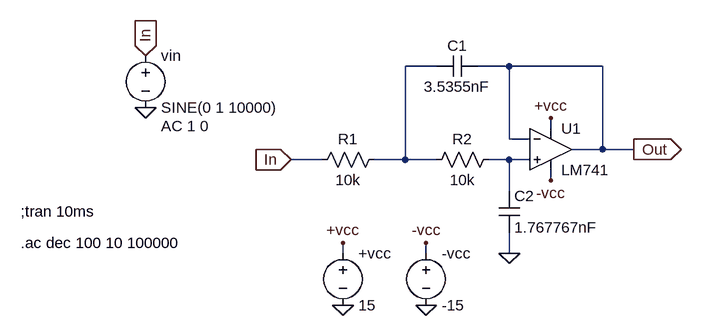
[diagram p0: schematic Butterworth.asc]
Butterworth.asc, the LTspice schematic file:
Version 4
SHEET 1 880 680
WIRE -16 16 -64 16
WIRE 96 16 48 16
WIRE 240 16 96 16
WIRE 160 112 160 96
WIRE 96 128 96 16
WIRE 128 128 96 128
WIRE 240 144 240 16
WIRE 240 144 192 144
WIRE 288 144 240 144
WIRE -192 160 -240 160
WIRE -64 160 -64 16
WIRE -64 160 -112 160
WIRE -16 160 -64 160
WIRE 96 160 64 160
WIRE 128 160 96 160
WIRE 160 192 160 176
WIRE 96 208 96 160
WIRE -160 304 -160 288
WIRE -32 304 -32 288
WIRE 96 304 96 272
FLAG 96 304 0
FLAG 288 144 Out
IOPIN 288 144 Out
FLAG -240 160 In
IOPIN -240 160 In
FLAG -464 0 In
IOPIN -464 0 In
FLAG -464 80 0
FLAG -160 288 +vcc
FLAG 160 96 +vcc
FLAG 160 192 -vcc
FLAG -160 384 0
FLAG -32 384 0
FLAG -32 288 -vcc
SYMBOL LM741 160 80 R0
SYMATTR InstName U1
SYMBOL res -96 144 R90
WINDOW 0 0 56 VBottom 2
WINDOW 3 32 56 VTop 2
SYMATTR InstName R1
SYMATTR Value 10k
SYMBOL res 80 144 R90
WINDOW 0 0 56 VBottom 2
WINDOW 3 32 56 VTop 2
SYMATTR InstName R2
SYMATTR Value 10k
SYMBOL cap 48 0 R90
WINDOW 0 0 32 VBottom 2
WINDOW 3 32 32 VTop 2
SYMATTR InstName C1
SYMATTR Value 3.5355nF
SYMBOL cap 80 208 R0
SYMATTR InstName C2
SYMATTR Value 1.767767nF
SYMBOL voltage -160 288 R0
WINDOW 123 0 0 Left 0
WINDOW 39 0 0 Left 0
SYMATTR InstName +vcc
SYMATTR Value 15
SYMBOL voltage -464 -16 R0
WINDOW 123 24 124 Left 2
WINDOW 39 0 0 Left 0
SYMATTR Value2 AC 1 0
SYMATTR InstName vin
SYMATTR Value SINE(0 1 10000)
SYMBOL voltage -32 288 R0
WINDOW 123 0 0 Left 0
WINDOW 39 0 0 Left 0
SYMATTR InstName -vcc
SYMATTR Value -15
TEXT -656 240 Left 2 !;tran 10ms
TEXT -656 288 Left 2 !.ac dec 100 10 100000

The netlist it stands for:
* Butterworth.asc
XU1 N002 Out +vcc -vcc Out LM741  ; pins In+ In- V+ V- OUT
R1 N001 In 10k
R2 N002 N001 10k
C1 Out N001 3.5355nF
C2 N002 0 1.767767nF
V§+vcc +vcc 0 15
vin In 0 SINE(0 1 10000) AC 1 0
V§-vcc -vcc 0 -15
;tran 10ms
.ac dec 100 10 100000
.lib LM741.lib
.backanno
.end